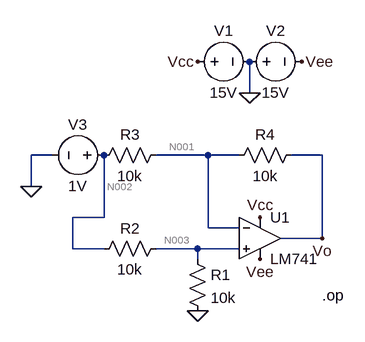
[diagram p0: schematic diff_amp_op_amp.asc]
diff_amp_op_amp.asc, the LTspice schematic file:
Version 4.1
SHEET 1 880 680
WIRE 176 -80 176 -128
WIRE -128 16 -160 16
WIRE 112 16 32 16
WIRE 160 16 112 16
WIRE 288 16 240 16
WIRE -160 64 -160 16
WIRE -48 112 -48 16
WIRE -48 112 -96 112
WIRE 112 128 112 16
WIRE 160 128 112 128
WIRE 288 144 288 16
WIRE 288 144 224 144
WIRE -96 160 -96 112
WIRE -48 160 -96 160
WIRE 96 160 32 160
WIRE 160 160 96 160
WIRE 96 176 96 160
FLAG 176 -80 0
FLAG 96 -128 Vcc
FLAG 256 -128 Vee
FLAG 192 112 Vcc
FLAG 192 176 Vee
FLAG 96 256 0
FLAG -160 64 0
FLAG 288 144 Vo
SYMBOL LM741 192 80 R0
SYMATTR InstName U1
SYMBOL voltage 80 -128 R270
WINDOW 0 32 56 VTop 2
WINDOW 3 -32 56 VBottom 2
WINDOW 123 0 0 Left 0
WINDOW 39 0 0 Left 0
SYMATTR InstName V1
SYMATTR Value 15V
SYMBOL voltage 160 -128 R270
WINDOW 0 32 56 VTop 2
WINDOW 3 -32 56 VBottom 2
WINDOW 123 0 0 Left 0
WINDOW 39 0 0 Left 0
SYMATTR InstName V2
SYMATTR Value 15V
SYMBOL res 80 160 R0
SYMATTR InstName R1
SYMATTR Value 10k
SYMBOL res 48 144 R90
WINDOW 0 0 56 VBottom 2
WINDOW 3 32 56 VTop 2
SYMATTR InstName R2
SYMATTR Value 10k
SYMBOL res 48 0 R90
WINDOW 0 0 56 VBottom 2
WINDOW 3 32 56 VTop 2
SYMATTR InstName R3
SYMATTR Value 10k
SYMBOL res 256 0 R90
WINDOW 0 0 56 VBottom 2
WINDOW 3 32 56 VTop 2
SYMATTR InstName R4
SYMATTR Value 10k
SYMBOL voltage -32 16 R90
WINDOW 0 -32 56 VBottom 2
WINDOW 3 32 56 VTop 2
WINDOW 123 0 0 Left 0
WINDOW 39 0 0 Left 0
SYMATTR InstName V3
SYMATTR Value 1V
TEXT 288 232 Left 2 !.op

The netlist it stands for:
* diff_amp_op_amp.asc
X§U1 N003 N001 Vcc Vee Vo LM741  ; pins In+ In- V+ V- OUT
V1 Vcc 0 15V
V2 0 Vee 15V
R1 N003 0 10k
R2 N003 N002 10k
R3 N001 N002 10k
R4 Vo N001 10k
V3 N002 0 1V
.op
.lib LM741.lib
.backanno
.end

* Results of the author's LTspice run, read from the files saved beside the schematic
* Operating Point:
*   V(n001) = 500.7 mV
*   V(vee) = -15 V
*   V(vo) = 2.472 mV
*   V(n003) = 499.7 mV
*   V(vcc) = 15 V
*   V(n002) = 1 V
*   I(V1) = -1.68 mA
*   I(R2) = -50.03 µA
*   I(R4) = -49.83 µA
*   I(V3) = -99.96 µA
*   I(R3) = -49.93 µA
*   I(V2) = -1.73 mA
*   I(R1) = 49.97 µA
*   Ix(u1:1) = 57.83 nA
*   Ix(u1:2) = 101.9 nA
*   Ix(u1:99) = 1.68 mA
*   Ix(u1:50) = -1.73 mA
*   Ix(u1:28) = 49.83 µA